# Altium schematic sheet ADCS.SchDoc
size A
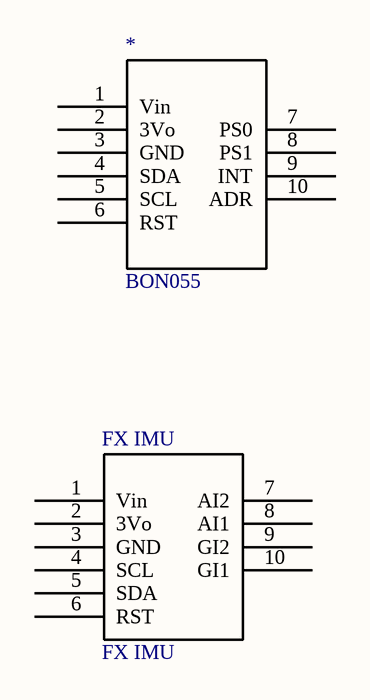
[diagram p0: ADCS.SchDoc]

## Parts
*  BON055  [BON055 IMU]
FX_IMU  FX IMU  [FX IMU]

## Nets

Not connected (* = marked no-connect by the designer): * 1(Vin) 2(3Vo) 3(GND) 4(SDA) 5(SCL) 6(RST) 7(PS0) 8(PS1) 9(INT) 10(ADR); FX_IMU 1(Vin) 2(3Vo) 3(GND) 4(SCL) 5(SDA) 6(RST) 7(AI2) 8(AI1) 9(GI2) 10(GI1)

## Library data of the parts
* = BON055: BON055 IMU